# Altium schematic sheet isoSPI-transceiver.SchDoc
size A3; DocumentNumber: 2; SheetNumber: 2; SheetTotal: 3; SheetDescription: isoSPI Transceiver
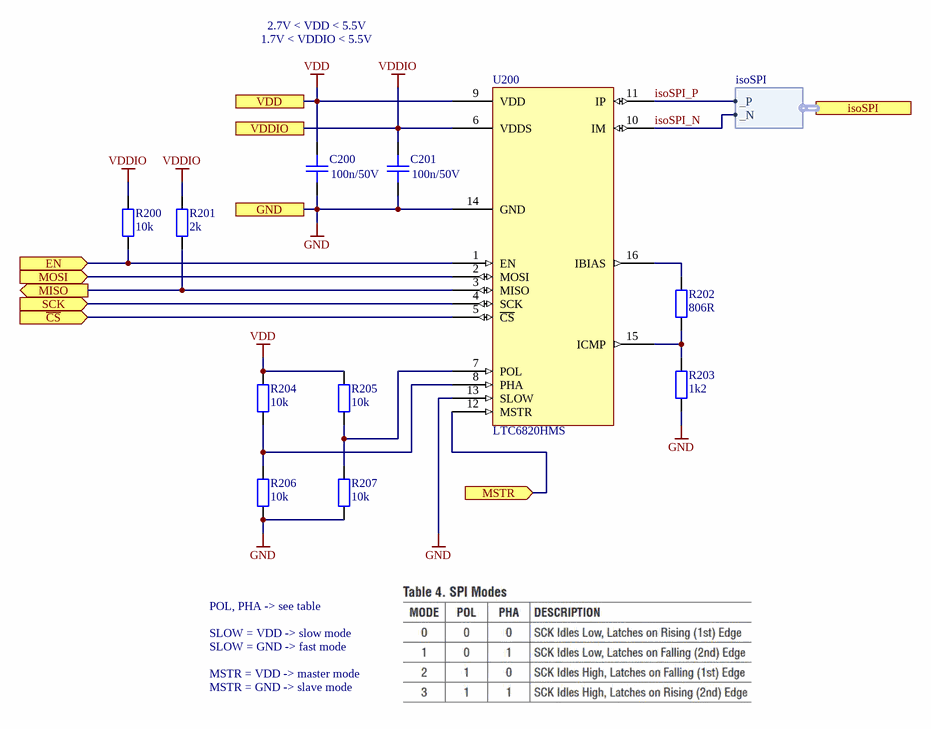
[diagram p0: isoSPI-transceiver.SchDoc]

## Parts
C200  100n/50V  [CAPC1608X08N]
C201  100n/50V  [CAPC1608X08N]
R200  10k  [RESC1608X05N]
R201  2k  [RESC1608X05N]
R202  806R  [RESC1608X05N]
R203  1k2  [RESC1608X05N]
R204  10k  [RESC1608X05N]
R205  10k  [RESC1608X05N]
R206  10k  [RESC1608X05N]
R207  10k  [RESC1608X05N]
U200  LTC6820HMS  [LTC6820-MSOP]

## Ports
EN (in), GND, isoSPI (harness isoSPI), MISO (out), MOSI (in), MSTR (in), SCK (in), VDD, VDDIO, ~{CS} (in)

## Harnesses
isoSPI: _P, _N

## Nets
GND: C200.1 C201.1 R203.1 R206.1 R207.1 U200.13(SLOW) U200.14(GND) ; port GND
VDD: C200.2 R204.2 R205.2 U200.9(VDD) ; port VDD
VDDIO: C201.2 R200.2 R201.2 U200.6(VDDS) ; port VDDIO
~{CS}: U200.5(~{CS}) ; port ~{CS}
EN: R200.1 U200.1(EN) ; port EN
isoSPI_N: U200.10(IM) ; port isoSPI._N
isoSPI_P: U200.11(IP) ; port isoSPI._P
MISO: R201.1 U200.3(MISO) ; port MISO
MOSI: U200.2(MOSI) ; port MOSI
MSTR: U200.12(MSTR) ; port MSTR
SCK: U200.4(SCK) ; port SCK
NetR202_1: R202.1 R203.2 U200.15(ICMP)
NetR202_2: R202.2 U200.16(IBIAS)
NetR204_1: R204.1 R206.2 U200.8(PHA)
NetR205_1: R205.1 R207.2 U200.7(POL)

## Notes on the sheet
- 2.7V < VDD < 5.5V
- 1.7V < VDDIO < 5.5V
- POL, PHA -> see table
- SLOW = VDD -> slow mode
- SLOW = GND -> fast mode
- MSTR = VDD -> master mode
- MSTR = GND -> slave mode
- Fraunhofer IISB
- Schottkystr. 10
- developed by:
- 91058 Erlangen
- Germany
- Author
- Project
- License
- Description
- File
- Version
- Release Date
- Sheet
- foxbms.org <https://foxbms.org>
- www.iisb.fraunhofer.de <https://www.iisb.fraunhofer.de/>
- foxBMS Team
- /

## Library data of the parts
C200 C201 = gen_C_ceramic_100n_50V_X7R_0603: MLCC; Capacitance: 100n; Rated Voltage: 50V; Dielectric: X7R; Case EIA: 0603; Case Metric: 1608; PnP Package: 0603C; PnP Value: 100nF/50V/X7R; PnP equipped: x; Automotive Qualified: True; AEC-Q Norm: AEC-Q200; Part Number: gen_C_ceramic_100n_50V_X7R_0603; Supplier 1: Farnell; Supplier Part Number 1: 2525267; ECCN: EAR99; Supplier 2: Digikey; Supplier Part Number 2: 490-6049-1-ND
R200 R204-R207 = gen_R_10k_0603: SMD Resistor 10k 0603; Tolerance: 1%; Power: 0.1W; Case EIA: 0603; Case Metric: 1608; Maximum Working Voltage: 75V; PnP Package: 0603R; Automotive Qualified: True; PnP equipped: x; Part Number: gen_R_10k_0603; Operating Temperature: -55°C - +155°C; Resistance: 10k; Series: E24, E96; PnP Value: 10k; Supplier 1: Farnell; Supplier Part Number 1: 2073349
R201 = gen_R_2k_0603: SMD Resistor 2k 0603; Tolerance: 1%; Power: 0.1W; Case EIA: 0603; Case Metric: 1608; Maximum Working Voltage: 75V; PnP Package: 0603R; Automotive Qualified: True; Part Number: gen_R_2k_0603; Operating Temperature: -55°C - +155°C; Resistance: 2k; Series: E24, E96; PnP Value: 2k; Supplier 1: Farnell; Supplier Part Number 1: 2059343
R202 = gen_R_806R_0603: SMD Resistor 806R 0603; Tolerance: 1%; Power: 0.1W; Case EIA: 0603; Case Metric: 1608; Maximum Working Voltage: 75V; PnP Package: 0603R; Automotive Qualified: True; Part Number: gen_R_806R_0603; Operating Temperature: -55°C - +155°C; Resistance: 806R; Series: E96; PnP Value: 806R; Supplier 1: Farnell; Supplier Part Number 1: 2059324
R203 = gen_R_1k2_0603: SMD Resistor 1k2 0603; Tolerance: 1%; Power: 0.1W; Case EIA: 0603; Case Metric: 1608; Maximum Working Voltage: 75V; PnP Package: 0603R; Automotive Qualified: True; Part Number: gen_R_1k2_0603; Operating Temperature: -55°C - +155°C; Resistance: 1k2; Series: E24; PnP Value: 1k2; Supplier 1: Farnell; Supplier Part Number 1: 2073370
U200 = LTC6820HMS: isoSPI Isolated Communications Interface; Manufacturer: Analog Devices; PnP Package: MSOP-16; Automotive Qualified: True; Part Number: LTC6820HMS; Part Name: LTC6820HMS; Operating Temperature: −40°C - +125°C; ComponentLink1Description: Datasheet; ComponentLink1URL: https://www.analog.com/media/en/technical-documentation/data-sheets/LTC6820.pdf; Supplier 1: Mouser; Supplier Part Number 1: 584-LTC6820HMS#PBF; Supplier 2: Digikey; Supplier Part Number 2: LTC6820HMS#TRPBFCT-ND